# EasyEDA Pro project ProPrj_Бабай (ByByte) Nano.epro

# Schematic main
Board Name: Board1; Create Date: 2025-09-03; Page Name: P1; Project Name: Бабай (ByByte) Lite; Schematic Name: main; Update Date: 2025-09-25; Company: EasyEDA.com; Page Size: A4; Version: V1.0
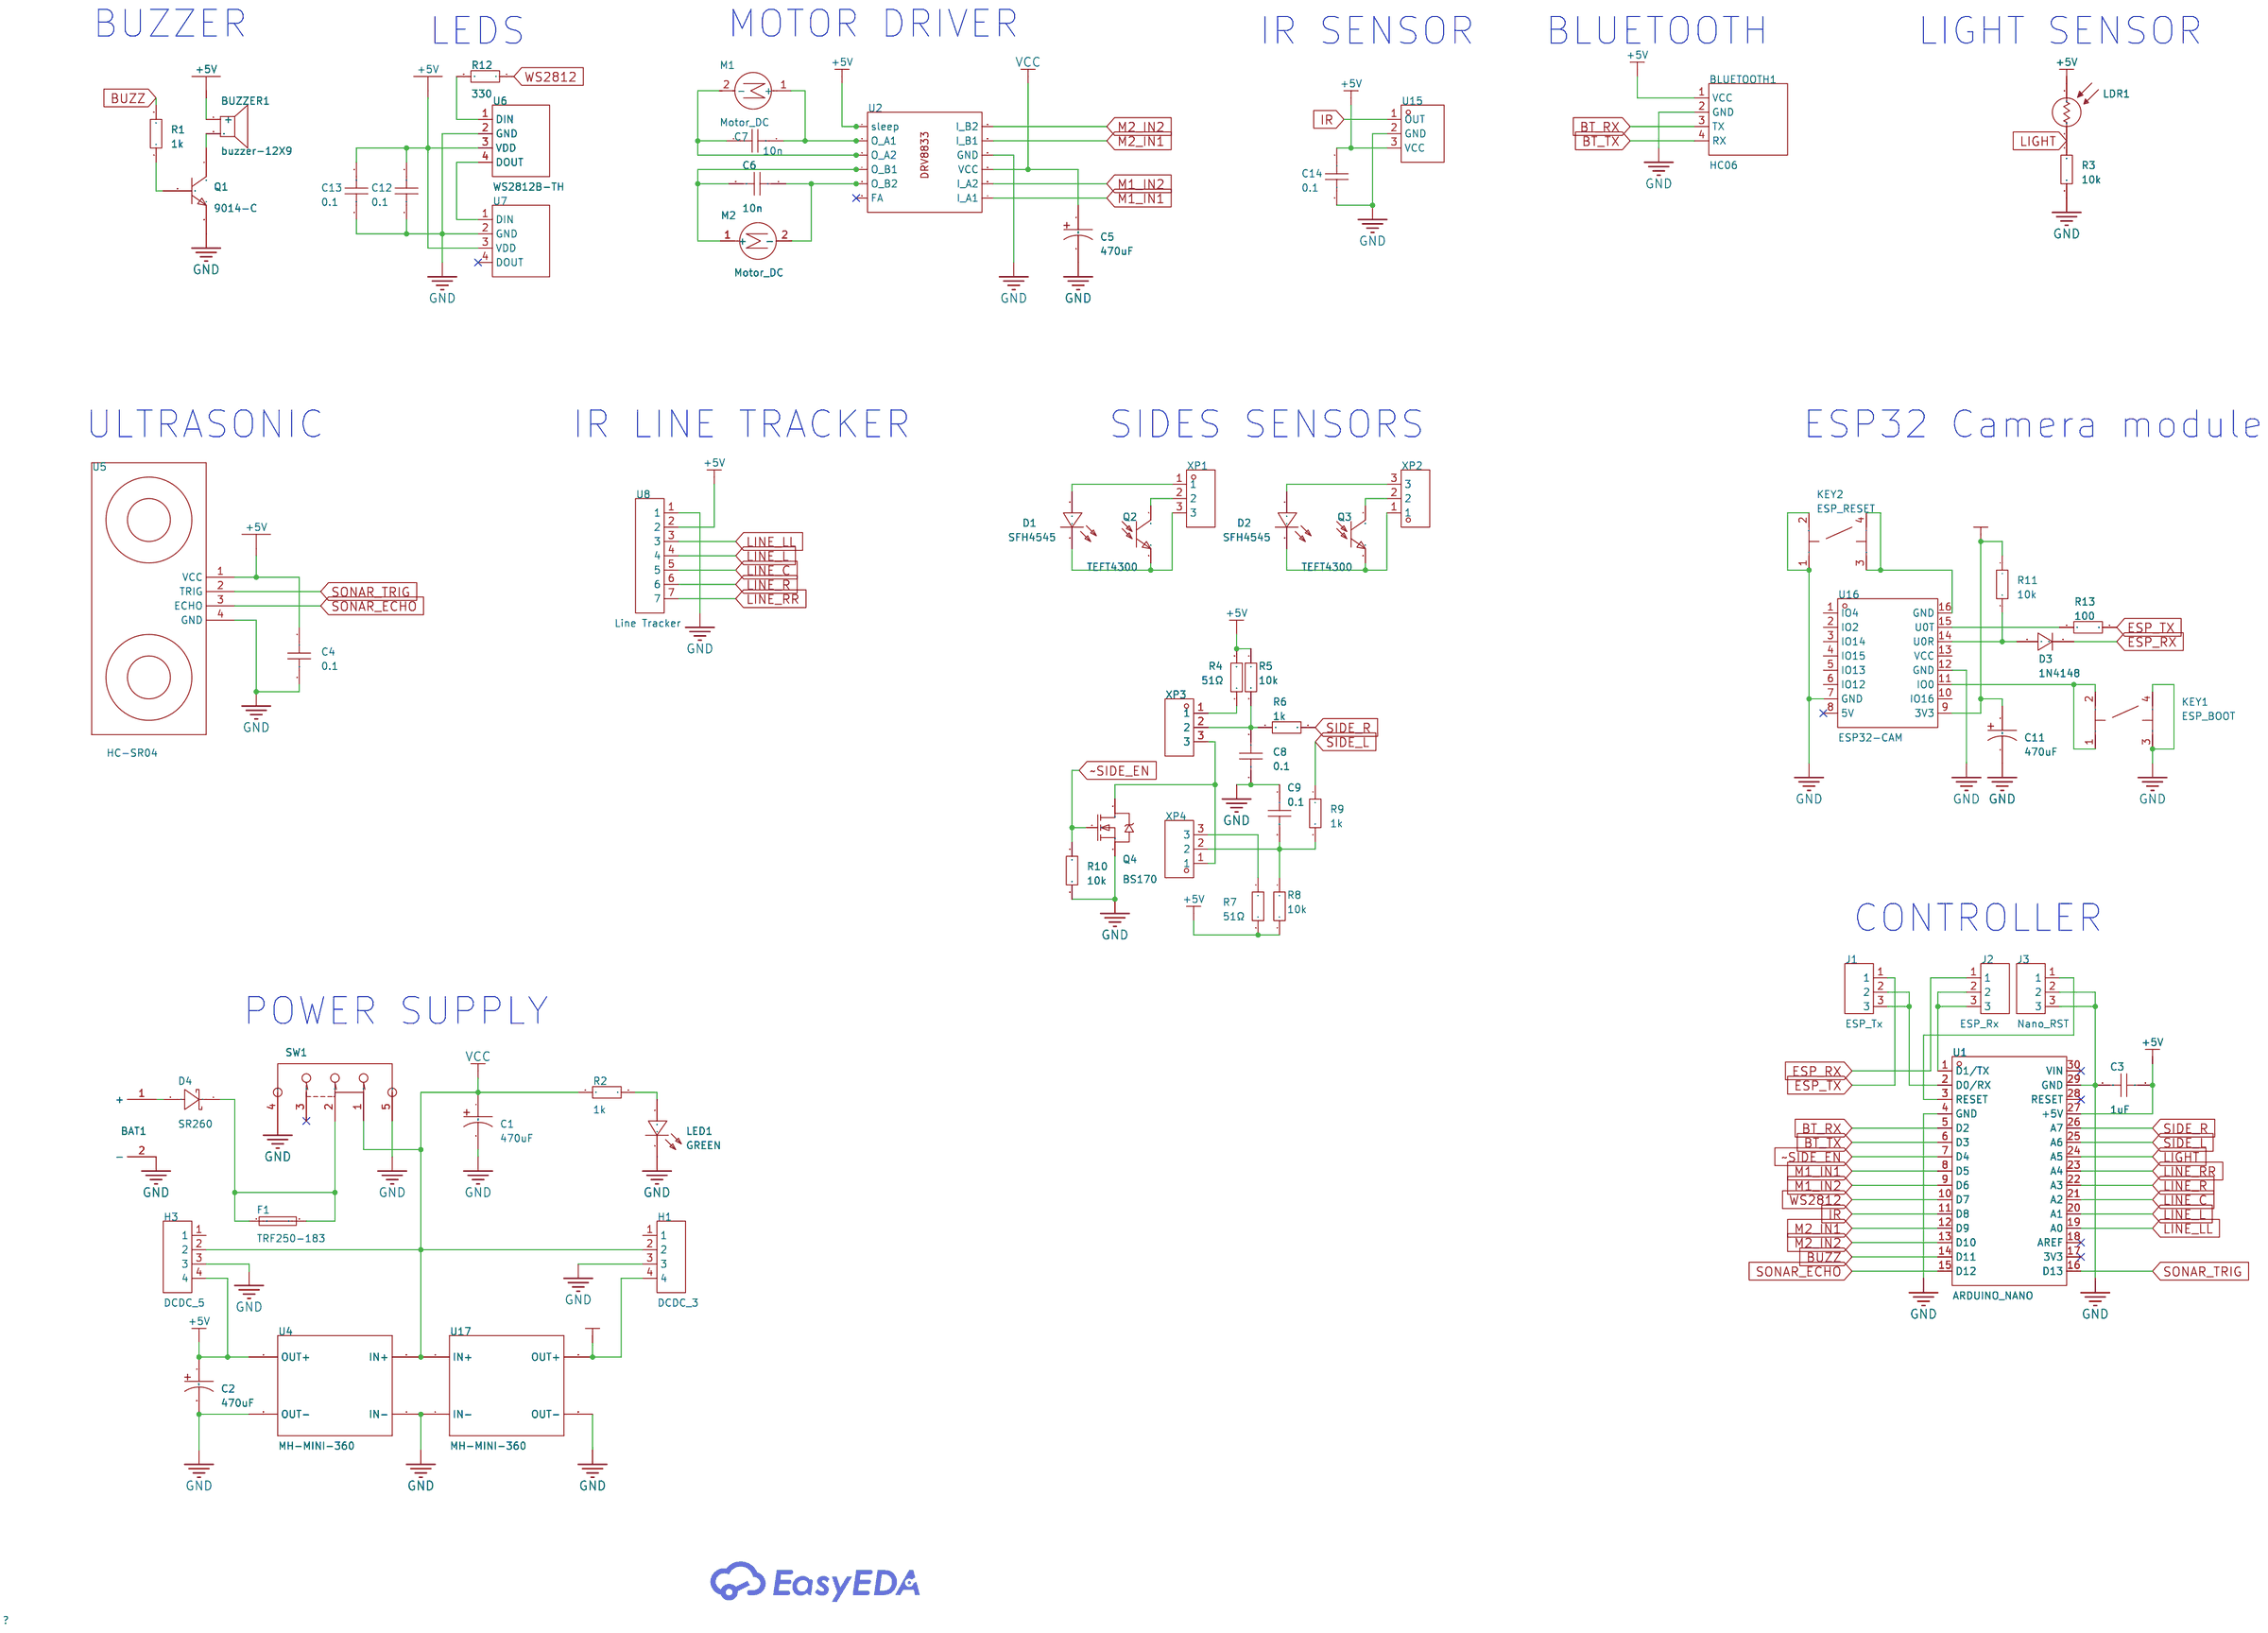
[diagram p0: schematic sheet]

## Parts
BAT1  -  [9V BATTERY]
BLUETOOTH1  HC06  [HC06]
BUZZER1  buzzer-12X9  [BUZ-TH_BD12.0-P7.60-D0.6-FD]
C1  470uF  [CAP-TH_BD8.0-P3.50-D0.6-FD-2]
C2  470uF  [CAP-TH_BD8.0-P3.50-D0.6-FD-2]
C3  1uF  [CAP-TH_L4.0-W2.5-P2.50-D0.5]
C4  0.1  [CAP-TH_L4.0-W2.5-P2.50-D0.5]
C5  470uF  [CAP-TH_BD8.0-P3.50-D0.6-FD-2]
C6  10n  [CAP-TH_L4.0-W2.5-P2.50-D0.5]
C7  10n  [CAP-TH_L4.0-W2.5-P2.50-D0.5]
C8  0.1  [CAP-TH_L4.0-W2.5-P2.50-D0.5]
C9  0.1  [CAP-TH_L4.0-W2.5-P2.50-D0.5]
C11  470uF  [CAP-TH_BD8.0-P3.50-D0.6-FD-2]
C12  0.1  [CAP-TH_L4.0-W2.5-P2.50-D0.5]
C13  0.1  [CAP-TH_L4.0-W2.5-P2.50-D0.5]
C14  0.1  [CAP-TH_L4.0-W2.5-P2.50-D0.5]
D1  SFH4545  [LED-TH_BD5.0-P2.54-FD]
D2  SFH4545  [LED-TH_BD5.0-P2.54-FD]
D3  1N4148  [DO-35_BD2.0-L4.0-P8.0-D0.5-RD]
D4  SR260  [Diode_THT:D_DO-15_P5.08mm_Vertical_KathodeUp]
F1  TRF250-183  [FUSE-TH_L7.5-W3.8-P5.00-D0.8]
H1  DCDC_3  [HDR-TH_4P-P2.54-V-F]
H3  DCDC_5  [HDR-TH_4P-P2.54-V-F]
J1  ESP_Tx  [HDR-TH_3P-P2.54-V-M-A]
J2  ESP_Rx  [HDR-TH_3P-P2.54-V-M-A]
J3  Nano_RST  [HDR-TH_3P-P2.54-V-M-A]
KEY1  ESP_BOOT  [KEY-TH_4P-L6.0-W6.0-P6.50-LS4.5]
KEY2  ESP_RESET  [KEY-TH_4P-L6.0-W6.0-P6.50-LS4.5]
LDR1  -  [PHOTO_RESISTOR]
LED1  PWR  [LED-TH_BD3.0-P2.54-FD-GREEN]
M1  Motor_DC  [N20_DC_MOTOR 3D]
M2  Motor_DC  [N20_DC_MOTOR 3D]
Q1  9014-C  [TO-92-3_L4.8-W3.7-P2.54-R]
Q2  TEFT4300  [SENSOR-TH_TEFT4300]
Q3  TEFT4300  [SENSOR-TH_TEFT4300]
Q4  BS170  [TO-92-3_L4.8-W3.7-P2.54-L]
R1  1k  [RES-TH_BD1.8-L3.2-P7.20-D0.4]
R2  1k  [RES-TH_BD1.8-L3.2-P7.20-D0.4]
R3  10k  [RES-TH_BD1.8-L3.2-P7.20-D0.4]
R4  51Ω  [R_AXIAL-0.4]
R5  10k  [RES-TH_BD1.8-L3.2-P7.20-D0.4]
R6  1k  [RES-TH_BD1.8-L3.2-P7.20-D0.4]
R7  51Ω  [R_AXIAL-0.4]
R8  10k  [RES-TH_BD1.8-L3.2-P7.20-D0.4]
R9  1k  [RES-TH_BD1.8-L3.2-P7.20-D0.4]
R10  10k  [RES-TH_BD1.8-L3.2-P7.20-D0.4]
R11  10k  [RES-TH_BD1.8-L3.2-P7.20-D0.4]
R12  330  [RES-TH_BD1.8-L3.2-P7.20-D0.4]
R13  100  [RES-TH_BD1.8-L3.2-P7.20-D0.4]
SW1  SW-TH_HOOYA_SS-12D11G4  [SW-TH_HOOYA_SS-12D11G4]
U1  ARDUINO_NANO  [COMM-TH_ARDUINO_NANO]
U2  -  [DRV8833]
U4  MH-MINI-360  [DC-DC-STEP-DOWN-MP2307]
U5  HC-SR04  [ULTRASONIC-HC-SR04#V]
U6  WS2812B-TH  [LED-TH_4P-BD5.8_WS2812B-TH]
U7  WS2812B-TH  [LED-TH_4P-BD5.8_WS2812B-TH]
U8  Line Tracker  [HDR-TH_7P-P2.54-V-F]
U15  D38  [OPTO-TH_VS1838B]
U16  ESP32-CAM  [COMM-TH_16P-L40.0-W27.0-P2.54_ESP32-CAM]
U17  MH-MINI-360  [DC-DC-STEP-DOWN-MP2307]
XP1  D32  [HDR-TH_3P-P2.54-V-M]
XP2  D32  [HDR-TH_3P-P2.54-V-M]
XP3  D32  [HDR-TH_3P-P2.54-V-M]
XP4  D32  [HDR-TH_3P-P2.54-V-M]

## Library data of the parts
BAT1 = BH9VPC: https://www.digikey.com/en/products/detail/mpd-memory-protection-devices/BH9VPC/31510
BLUETOOTH1 = HC06: Supplier: LCSC; _: 3
BUZZER1 = BUZZER-12X9: Supplier Part: C9900016920; Supplier Footprint: BUZZER_SMT_9650B; Datasheet: https://atta.szlcsc.comnull; Supplier: LCSC
C1 C2 C5 C11 = RXW471M1CBK-0811: Capacitance:470uF Tolerance:±20% Tolerance:±20% Voltage Rating:16V Ripple Current:- Equivalent Series Resistance(ESR):- Pin Spacing:3.5mm Diameter:8mm Height - Seated (Max):11.5mm Lifetime:5000hrs@105℃; LCSC Part Name: 470uF ±20% 16V; Supplier Part: C134658; Manufacturer: Lelon(立隆); Supplier Footprint: 插件,D8xL11.5mm; JLCPCB Part Class: Extended Part; Datasheet: https://atta.szlcsc.com/upload/public/pdf/source/20190613/C384650_EFEC9297B5607DDE202AAAD5E3F76F5E.pdf; Supplier: LCSC; Tolerance: ±20%; Voltage Rating: 16V; Pin Spacing: 3.5mm; Diameter: 8mm; Height - Seated (Max): 11.5mm; Lifetime: 5000hrs@105℃
C3 C4 C6-C9 C12-C14 = FK18X5R1C105K: Capacitance: Tolerance:±10% Tolerance:±10% Voltage Rated: Temperature Coefficient:; LCSC Part Name: 1uF ±10% 16V; Supplier Part: C3693472; Manufacturer: TDK; JLCPCB Part Class: Extended Part; Datasheet: https://atta.szlcsc.com/upload/public/pdf/source/20171113/C140866_15105613015131115783.pdf; Supplier: LCSC; Tolerance: ±10%
D1 D2 = SFH4550: Supplier Part: C706747; Supplier: LCSC
D3 = 1N4148: Diode Configuration: Forward Voltage (Vf@If):- Reverse Voltage (Vr):- Average Rectified Current (Io):- Reverse Leakage Current:-; Supplier Part: C13769; Supplier Footprint: DO-35; JLCPCB Part Class: Extended Part; Supplier: LCSC
D4 = SR260: Diode Configuration:- Forward Voltage (Vf@If):700mV@2A Reverse Voltage (Vr):60V Rectified Current:2A Reverse Leakage Current (Ir):500uA@60V; LCSC Part Name: 电压:60V 电流:2A 停产; Supplier Part: C845406; Manufacturer: TF(拓锋); Supplier Footprint: DO-15; JLCPCB Part Class: Extended Part; Datasheet: https://atta.szlcsc.com/upload/public/pdf/source/20201103/C845406_FC0B483EC48C96AC55EDB1AB9BB06A33.pdf; Supplier: LCSC; Forward Voltage (Vf@If): 700mV@2A; Reverse Voltage (Vr): 60V; Rectified Current: 2A; Reverse Leakage Current (Ir): 500uA@60V
F1 = TRF250-183: Voltage - Max:100V Current - Max:10A Hold Current:183mA Trip Current:685mA Power Dissipation:900mW Resistance - Initial (Ri) (Min):600mΩ Resistance - Post Trip (R1) (Max):3.4Ω Time to Trip(Max):600ms Operating Temperature:-40℃~+85℃ Operating Temperature:-; LCSC Part Name: 250V 0.183A; Supplier Part: C413573; Manufacturer: Littelfuse(美国力特); Supplier Footprint: 插件; JLCPCB Part Class: Extended Part; Datasheet: https://item.szlcsc.com/datasheet/TRF250-183/405574.html; Supplier: LCSC; Voltage - Max: 100V; Current - Max: 10A; Hold Current: 183mA; Trip Current: 685mA; Power Dissipation: 900mW; Resistance - Initial (Ri) (Min): 600mΩ; Resistance - Post Trip (R1) (Max): 3.4Ω; Time to Trip(Max): 600ms; Operating Temperature: -40℃~+85℃
H1 H3 = HC-08蓝牙: Supplier Part: C9900016778; Supplier Footprint: HDR-TH_4P; JLCPCB Part Class: Extended Part; Supplier: LCSC
J1-J3 = Jumper3: Supplier Part: C2940050; Supplier Footprint: HDR-TH-3P-2.54mm; JLCPCB Part Class: Extended Part; Supplier: LCSC
KEY1 KEY2 = AN6*6: Supplier Part: C9900018275; Supplier Footprint: KEY-TH_4P-L6.0-W6.0-P4.50-LS6.50; JLCPCB Part Class: Extended Part; Supplier: LCSC
LDR1 = Photo-Resistor
LED1 = 插针式LEDF3: Supplier Part: C9900017231; Manufacturer Part: GREEN; Supplier Footprint: LED-TH_BD3.0; JLCPCB Part Class: Extended Part; Supplier: LCSC
M1 M2 = Motor_DC: license: https://www.gnu.org/licenses/lgpl-2.1.html
Q1 = 9014-C: type:NPN Current - Collector(Ic): Collector - Emitter Voltage VCEO: Pd - Power Dissipation: DC Current Gain:200@1mA,5V DC Current Gain:200@1mA,5V Transition frequency(fT):270MHz Current - Collector Cutoff:50nA Vce Saturation(VCE(sat)):140mV Operating Temp; Supplier Part: C305409; Manufacturer: BLUE ROCKET(蓝箭); Supplier Footprint: TO-92-3; Datasheet: https://atta.szlcsc.com/upload/public/pdf/source/20181016/C305409_957E989EA97400765401B68B49A4FDD8.pdf; Supplier: LCSC; type: NPN; DC Current Gain: 200@1mA,5V; Transition frequency(fT): 270MHz; Current - Collector Cutoff: 50nA; Vce Saturation(VCE(sat)): 140mV
Q2 Q3 = TEFT4300: Transistor Type:NPN Collector Emitter Voltage:70V Collector Emitter Voltage:70V Collector Current (Ic):50mA Dissipation Power(Max):100mW Collector Dark Current:1nA Peak Wavelength:925nm Viewing Angle:±30° Operating Temperature:-40℃~+100℃ Operating Tempera; LCSC Part Name: 925nm的NPN光电三极管; Supplier Part: C118301; Manufacturer: VISHAY(威世); Supplier Footprint: 插件,D=3mm; JLCPCB Part Class: Extended Part; Datasheet: https://atta.szlcsc.com/upload/public/pdf/source/20170713/C118301_1499918878961816729.pdf; Supplier: LCSC; Transistor Type: NPN; Collector Emitter Voltage: 70V; Collector Current (Ic): 50mA; Dissipation Power(Max): 100mW; Collector Dark Current: 1nA; Peak Wavelength: 925nm; Viewing Angle: ±30°; Operating Temperature: -40℃~+100℃
Q4 = BS170-D26Z: Type:1 N-Channel Drain Source Voltage (Vdss): Continuous Drain Current (Id): Drain Source On Resistance (RDS(on)@Vgs,Id):5Ω@10V,200mA Power Dissipation (Pd): Gate Threshold Voltage (Vgs(th)@Id):3V@1mA Input Capacitance (Ciss@Vds):40pF@10V Operating Temper; LCSC Part Name: 1个N沟道 耐压:60V 电流:500mA; Supplier Part: C258163; Manufacturer: onsemi(安森美); Supplier Footprint: TO-92-3; JLCPCB Part Class: Extended Part; Datasheet: https://atta.szlcsc.com/upload/public/pdf/source/20180829/C258163_1806696338258A85C7E3E0B8B7F025DB.pdf; Supplier: LCSC; Type: 1 N-Channel; Drain Source On Resistance (RDS(on)@Vgs,Id): 5Ω@10V,200mA; Gate Threshold Voltage (Vgs(th)@Id): 3V@1mA; Input Capacitance (Ciss@Vds): 40pF@10V; Operating Temperature: -55℃~+150℃@(Tj)
R1-R3 R5 R6 R8-R13 = Res_AXIAL-1/8W: Supplier Footprint: Through
R4 R7 = Res_AXIAL-1/4W: Supplier Footprint: Through
SW1 = SW-TH_HOOYA_SS-12D11G4: link: https://atta.szlcsc.com/upload/public/pdf/source/20220518/EE8C01AB75DB93BD50D8A6D13330ACA3.pdf
U1 = ARDUINO_NANO: Supplier Part: C9900017879; Supplier Footprint: 插件; JLCPCB Part Class: Extended Part; Supplier: LCSC
U2 = DRV8833
U4 U17 = #promini_DC-DC-STEP-DOWN-MP2307_
U5 = ULTRASONIC-HC-SR04_#V
U6 U7 = WS2812B-TH: Supplier Part: C9900193997; Supplier Footprint: 插件; Supplier: LCSC
U8 = 7位插座: Supplier Part: C9900023763; Supplier Footprint: HDR-TH-7P; JLCPCB Part Class: Extended Part; Supplier: LCSC
U15 = VS1838B: Supplier Part: C9900002107; Supplier Footprint: TH-3_4.8X6.7X2.54P; Supplier: LCSC
U16 = ESP32-CAM: ESP32-CAM_AI-THINKER; Supplier Part: C277946; Manufacturer: Ai-Thinker(安信可); Supplier Footprint: 插件; JLCPCB Part Class: Extended Part; Datasheet: https://atta.szlcsc.com/upload/public/pdf/source/20180906/C277946_000C39242C68478A3C556AF60BF76A1F.pdf; Supplier: LCSC
XP1-XP4 = 5-146277-3: Pitch:2.54mm Circluar Pins/Square Pins:Square Pins Mounting Type:Straight Number of Rows:Plugin Number of Pins:3P Current Rating (Max):3A Voltage Rating (Max):- Length of Mating Pin:8.08mm Insulation Height:2.29mm Length of End Connection Pin:3.18mm Conta; LCSC Part Name: 间距:2.54mm 直插 方针; Supplier Part: C3327863; Manufacturer: TE Connectivity(泰科电子); Supplier Footprint: 插件,P=2.54mm; JLCPCB Part Class: Extended Part; Datasheet: https://atta.szlcsc.com/upload/public/pdf/source/20240320/B5A87472A4F0F2898233D24AD0789840.pdf; Supplier: LCSC; Pitch: 2.54mm; Circluar Pins/Square Pins: Square Pins; Mounting Type: Straight; Number of Rows: Plugin; Number of Pins: 3P; Current Rating (Max): 3A; Length of Mating Pin: 8.08mm; Insulation Height: 2.29mm; Length of End Connection Pin: 3.18mm; Contact Plating: Tin; Operating Temperature Range: -65℃~+105℃; Color: Black

## Nets
+3.3V: C11.1 H1.4 R11.1 U16.9(3V3) U17.OUT+
+5V: BLUETOOTH1.1(VCC) BUZZER1.1(+) C2.1 C3.2 C4.1 C12.1 C13.1 C14.1 H3.4 LDR1.1 R4.2 R5.1 R7.2 R8.2 U1.27(+5V) U2.1(sleep) U4.OUT+ U5.1(VCC) U6.3(VDD) U7.3(VDD) U8.2 U15.3(VCC)
GND: BAT1.2(-) BLUETOOTH1.2(GND) C1.2 C2.2 C3.1 C4.2 C5.2 C8.1 C9.1 C11.2 C12.2 C13.2 C14.2 H1.3 H3.3 J3.2 J3.3 KEY1.3 KEY1.4 KEY2.1 KEY2.2 LED1.2(K) Q1.3(E) Q4.3(S) R3.1 R10.2 SW1.4 SW1.5 U1.4(GND) U1.29(GND) U2.10(GND) U4.IN- U4.OUT- U5.4(GND) U6.2(GND) U7.2(GND) U8.1 U15.2(GND) U16.7(GND) U16.12(GND) U17.IN- U17.OUT-
VCC: C1.1 C5.1 H1.2 H3.2 R2.2 SW1.1 U2.9(VCC) U4.IN+ U17.IN+
BT_RX: BLUETOOTH1.3(TX) U1.5(D2)
BT_TX: BLUETOOTH1.4(RX) U1.6(D3)
BUZZ: R1.2 U1.14(D11)
ESP_RX: D3.1 J2.1
ESP_TX: J1.1 R13.2
IR: U1.11(D8) U15.1(OUT)
LIGHT: LDR1.2 R3.2 U1.24(A5)
LINE_C: U1.21(A2) U8.5
LINE_L: U1.20(A1) U8.4
LINE_LL: U1.19(A0) U8.3
LINE_R: U1.22(A3) U8.6
LINE_RR: U1.23(A4) U8.7
M1_IN1: U1.8(D5) U2.7(I_A1)
M1_IN2: U1.9(D6) U2.8(I_A2)
M2_IN1: U1.12(D9) U2.11(I_B1)
M2_IN2: U1.13(D10) U2.12(I_B2)
SIDE_L: R9.1 U1.25(A6)
SIDE_R: R6.1 U1.26(A7)
SONAR_ECHO: U1.15(D12) U5.3(ECHO)
SONAR_TRIG: U1.16(D13) U5.2(TRIG)
WS2812: R12.1 U1.10(D7)
~SIDE_EN: Q4.2(G) R10.1 U1.7(D4)
$1N1464: Q1.2(B) R1.1
$1N1467: BUZZER1.2 Q1.1(C)
$1N1626: R12.2 U6.1(DIN)
$1N1633: U6.4(DOUT) U7.1(DIN)
$1N4176: LED1.1(A) R2.1
$1N4272: C7.2 M1.1(+) U2.2(O_A1)
$1N4279: C7.1 M1.2(-) U2.3(O_A2)
$1N5250: Q2.1(C) XP1.2
$1N5251: D1.2(K) Q2.2(E) XP1.3
$1N5405: D1.1(A) XP1.1
$1N5525: D2.2(K) Q3.2(E) XP2.1
$1N5528: Q3.1(C) XP2.2
$1N5529: D2.1(A) XP2.3
$1N5700: R4.1 XP3.1
$1N5728: C8.2 R5.2 R6.2 XP3.2
$1N5983: R7.1 XP4.3
$1N6012: C9.2 R8.1 R9.2 XP4.2
$1N6146: Q4.1(D) XP3.3 XP4.1
$1N7817: J3.1 U1.3(RESET)
$1N7877: J2.2 J2.3 U1.1(D1/TX)
$1N8038: D3.2 R11.2 U16.14(U0R)
$1N8431: KEY1.1 KEY1.2 U16.11(IO0)
$1N8535: KEY2.3 KEY2.4 U16.16(GND)
$1N9044: C6.2 M2.1(+) U2.4(O_B1)
$1N9105: C6.1 M2.2(-) U2.5(O_B2)
$1N12441: R13.1 U16.15(U0T)
$1N12605: J1.2 J1.3 U1.2(D0/RX)
$1N12810: D4.1(K) F1.1 F1.2 SW1.2
$1N12946: BAT1.1(+) D4.2(A)

Not connected (* = marked no-connect by the designer): H1 1; H3 1; SW1 3*; U1 17(3V3)* 18(AREF)* 28(RESET)* 30(VIN)*; U2 6(FA)*; U7 4(DOUT)*; U16 1(IO4) 2(IO2) 3(IO14) 4(IO15) 5(IO13) 6(IO12) 8(5V)* 10(IO16) 13(VCC)

## Notes on the sheet
- BUZZER
- MOTOR DRIVER
- LEDS
- IR SENSOR
- BLUETOOTH
- LIGHT SENSOR
- ULTRASONIC
- IR LINE TRACKER
- SIDES SENSORS
- ESP32 Camera module
- CONTROLLER
- POWER SUPPLY

# Board PCB1
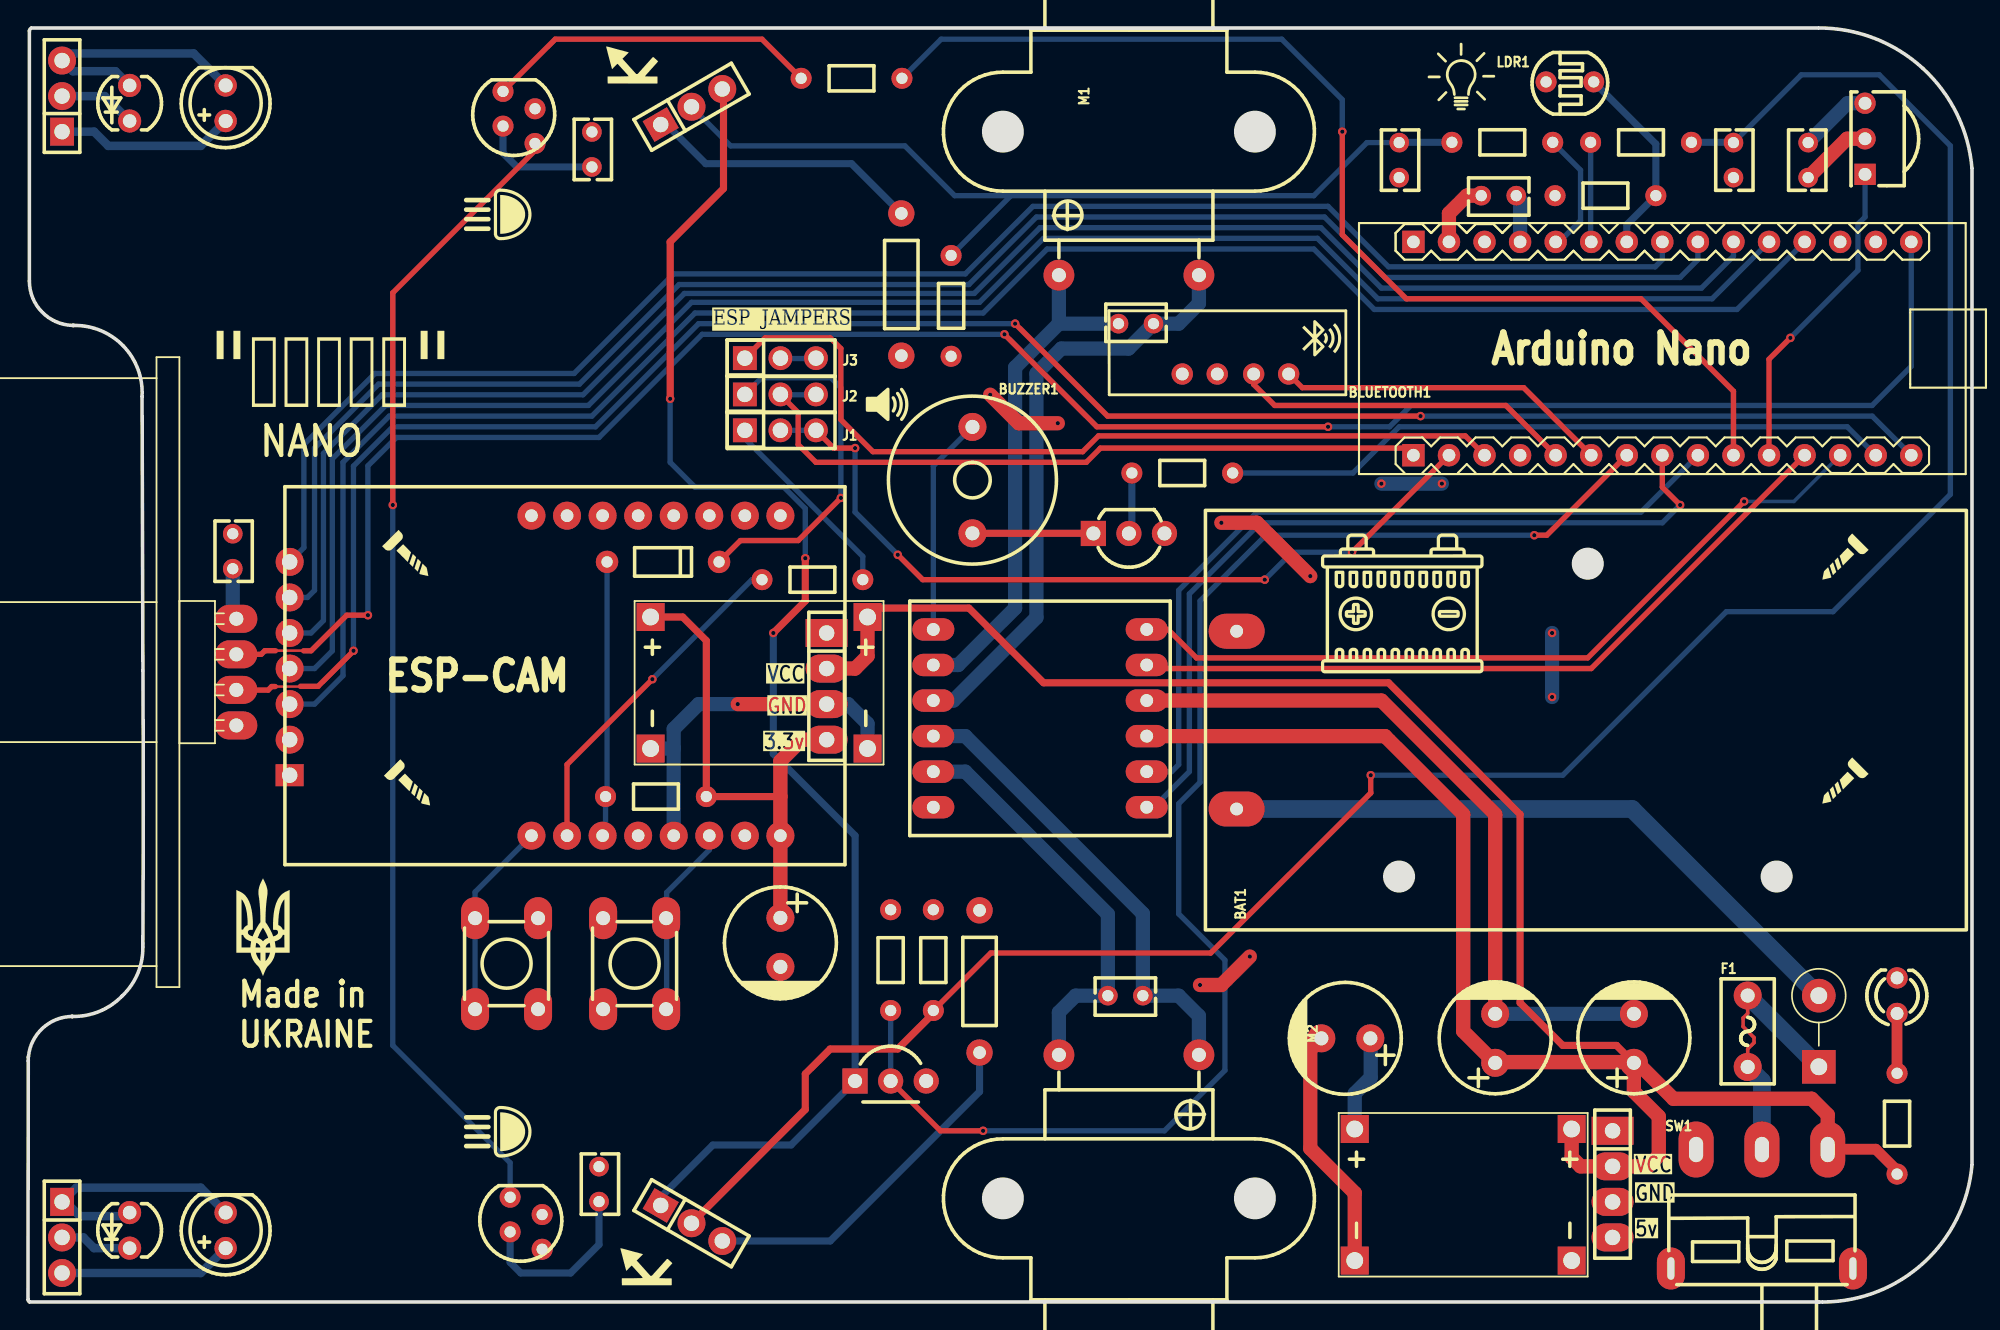
[diagram p1: board, top side]
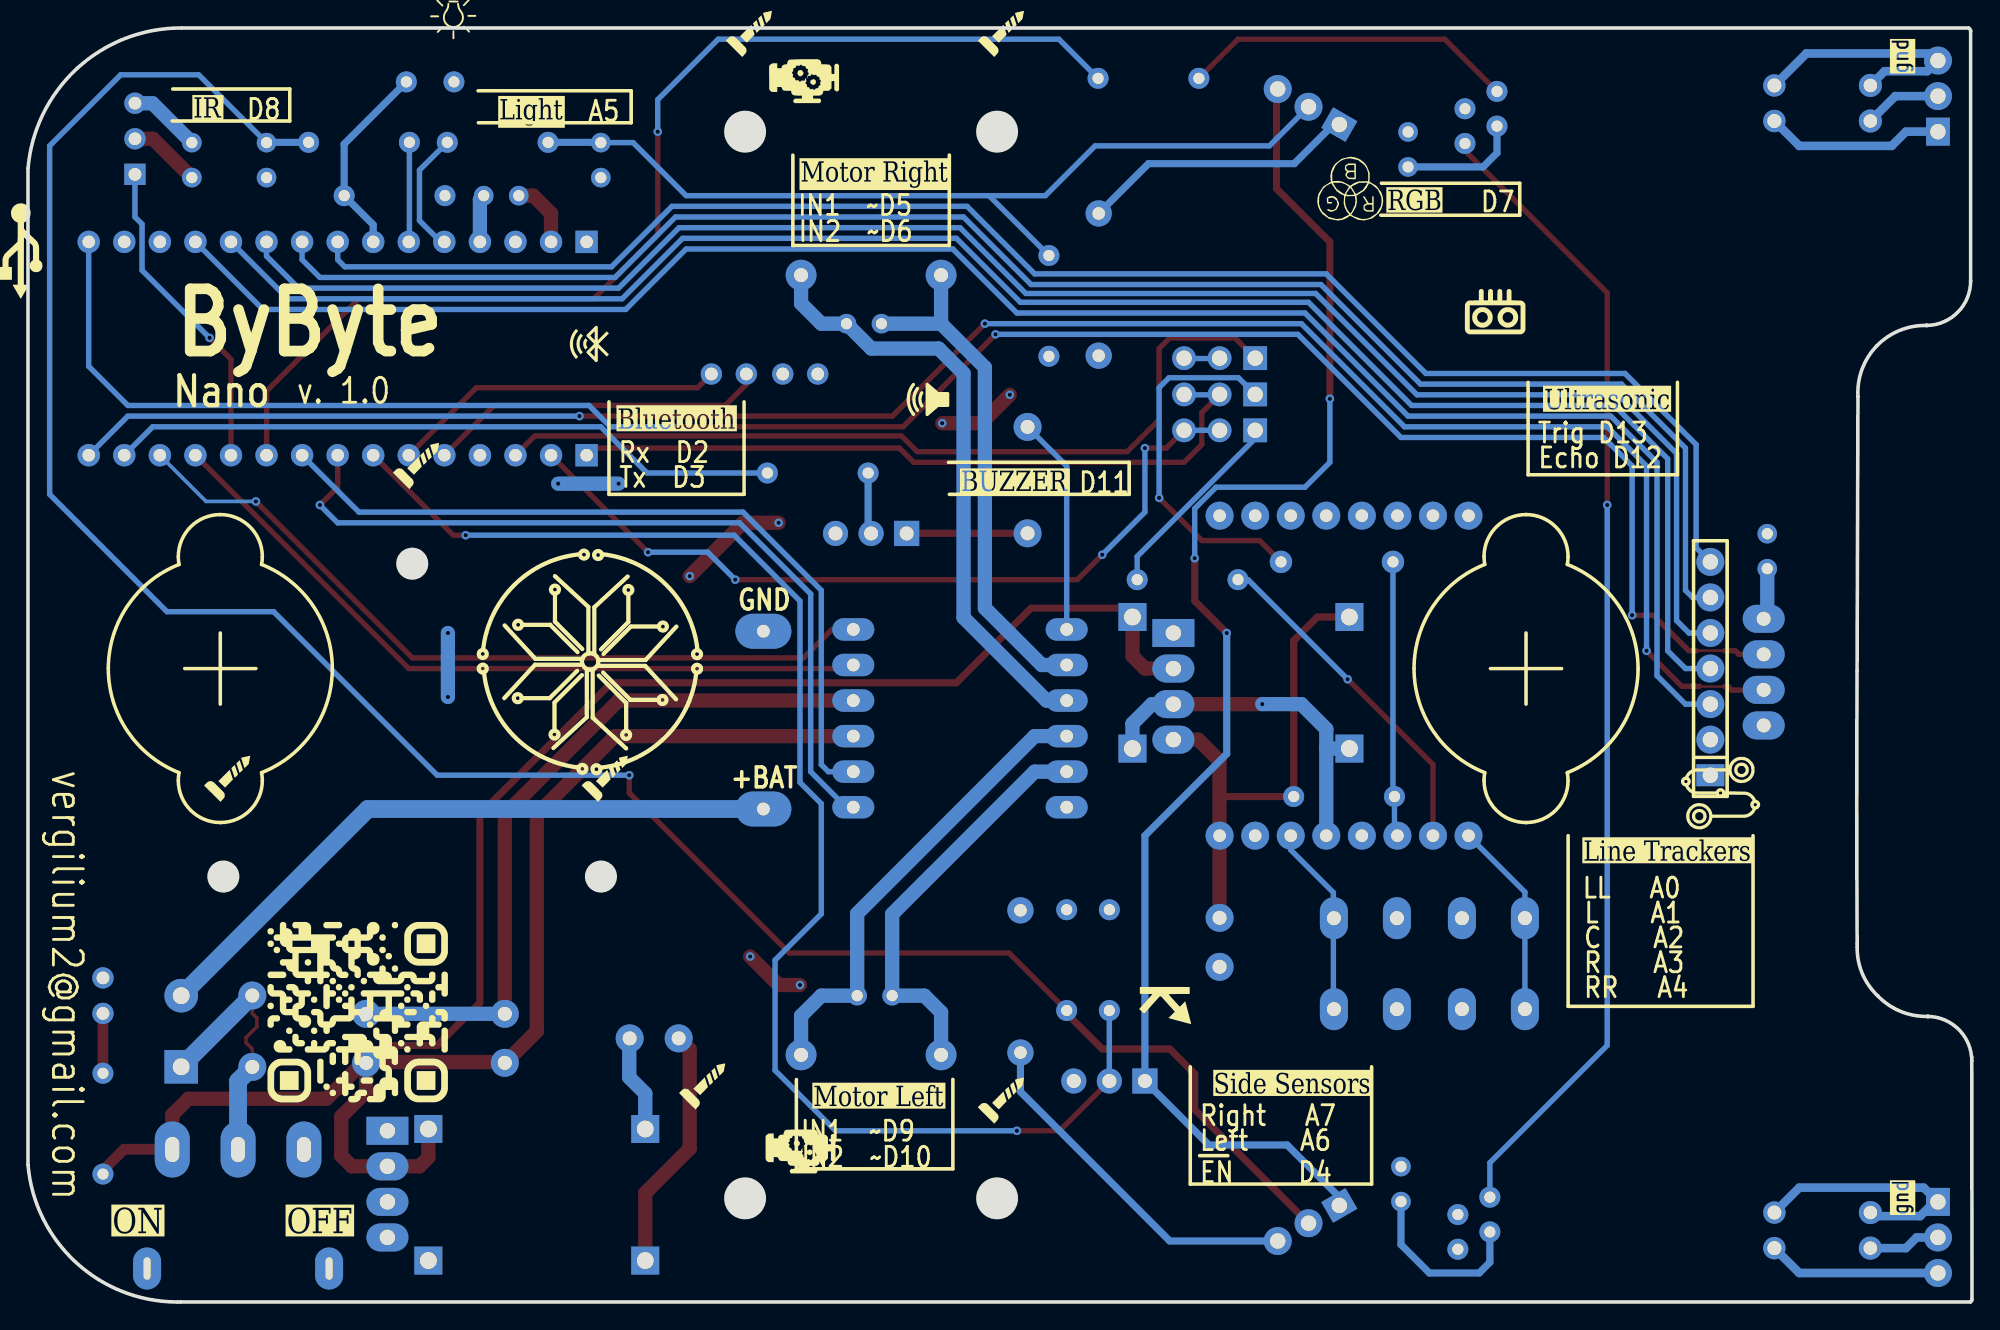
[diagram p2: board, bottom side, seen from below]

Outline 138.85 x 91.01 mm; copper layers: Top Layer, Bottom Layer. Coordinates in mm from the lower left corner of the outline.
Outline path: 0,0.19 0.02,17.22 arc(0.02,17.23) 0.02,17.23 0.02,17.48 arc(0.02,17.51) 0.03,17.54 arc(1.03,19.55) 3.12,20.4 arc(3.13,20.4) 3.14,20.4 arc(3.15,20.4) 3.16,20.39 arc(3.17,20.4) 3.18,20.4 arc(3.19,20.4) 3.2,20.4 arc(5.12,20.77) 6.74,21.88 arc(7.84,23.47) 8.2,25.37 8.2,25.61 arc(8.22,35.35) 8.21,45.09 8.15,64.69 arc(7.86,66.63) 6.82,68.29 arc(5.2,69.39) 3.28,69.76 arc(3.27,69.76) 3.25,69.76 arc(3.24,69.77) 3.24,69.77 arc(3.23,69.77) 3.22,69.76 arc(3.21,69.76) 3.2,69.76 arc(1,70.72) 0.1,72.94 0.1,90.8 arc(0.14,90.93) 0.25,91.01 127.89,91.01 arc(131.88,90.27) 135.33,88.13 arc(137.77,84.88) 138.85,80.97 138.85,9.8 arc(135.42,2.82) 128.17,0 arc(128.05,0) 127.93,0 0.12,0 arc(0.03,0.08) 0,0.19
Stack: Top Layer 0.035mm / Dielectric1 1.51mm FR4 er 4.5 / Bottom Layer 0.035mm

## Design rules (mm)
template: JLCPCB Capability(Two Layers Board)
spacing copperThickness1oz (default): track to track 0.102, other pairs 0.152 to 0.3
spacing copperThickness2oz: track to track 0.203, other pairs 0.152 to 0.3
track width copperThickness1oz (default): min 0.127, default 0.254, max 2.54
track width copperThickness2oz: min 0.203, default 0.254, max 2.54
differential pair differentialPair (default): width min 0.127, default 0.254, max 2.54; gap min 0.152, default 0.152
via viaSize (default): diameter min 0.5, default 0.61, max 10; hole min 0.3, default 0.305, max 6.3

## Placement (name value [footprint] x y rotation side)
BAT1  -  [9V BATTERY]  111.14 41.95 180 top
BLUETOOTH1  -  [HC06]  94.13 64.81 180 top
BUZZER1  buzzer-12X9  [BUZ-TH_BD12.0-P7.60-D0.6-FD]  67.46 58.71 270 top
C1  470uF  [CAP-TH_BD8.0-P3.50-D0.6-FD-2]  114.7 18.84 90 top
C2  470uF  [CAP-TH_BD8.0-P3.50-D0.6-FD-2]  94.13 18.84 180 top
C3  1uF  [CAP-TH_L4.0-W2.5-P2.50-D0.5]  105.05 79.03 0 top
C4  0.1  [CAP-TH_L4.0-W2.5-P2.50-D0.5]  14.62 53.63 90 top
C5  470uF  [CAP-TH_BD8.0-P3.50-D0.6-FD-2]  104.79 18.84 90 top
C6  10n  [CAP-TH_L4.0-W2.5-P2.50-D0.5]  78.38 21.88 0 top
C7  10n  [CAP-TH_L4.0-W2.5-P2.50-D0.5]  79.14 69.89 180 top
C8  0.1  [CAP-TH_L4.0-W2.5-P2.50-D0.5]  97.94 81.57 90 top
C9  0.1  [CAP-TH_L4.0-W2.5-P2.50-D0.5]  121.81 81.57 90 top
C11  470uF  [CAP-TH_BD8.0-P3.50-D0.6-FD-2]  53.74 25.69 270 top
C12  0.1  [CAP-TH_L4.0-W2.5-P2.50-D0.5]  40.28 82.34 90 top
C13  0.1  [CAP-TH_L4.0-W2.5-P2.50-D0.5]  40.79 8.42 90 top
C14  0.1  [CAP-TH_L4.0-W2.5-P2.50-D0.5]  127.15 81.57 270 top
D1  SFH4545  [LED-TH_BD5.0-P2.54-FD]  14.12 85.64 90 top
D2  SFH4545  [LED-TH_BD5.0-P2.54-FD]  14.12 5.12 90 top
D3  1N4148  [DO-35_BD2.0-L4.0-P8.0-D0.5-RD]  45.36 52.87 180 top
D4  SR260  [Diode_THT:D_DO-15_P5.08mm_Vertical_KathodeUp]  127.91 16.8 90 top
F1  TRF250-183  [FUSE-TH_L7.5-W3.8-P5.00-D0.8]  122.83 19.34 270 top
H1  DCDC_3  [HDR-TH_4P-P2.54-V-F]  57.04 43.98 270 top
H3  DCDC_5  [HDR-TH_4P-P2.54-V-F]  113.18 8.42 270 top
J1  ESP_Tx  [HDR-TH_3P-P2.54-V-M-A]  53.74 62.27 0 top
J2  ESP_Rx  [HDR-TH_3P-P2.54-V-M-A]  53.74 64.84 0 top
J3  Nano_RST  [HDR-TH_3P-P2.54-V-M-A]  53.74 67.43 0 top
KEY1  ESP_BOOT  [KEY-TH_4P-L6.0-W6.0-P6.50-LS4.5]  43.33 24.17 270 top
KEY2  ESP_RESET  [KEY-TH_4P-L6.0-W6.0-P6.50-LS4.5]  34.18 24.17 270 top
LDR1  -  [PHOTO_RESISTOR]  110.13 87.16 90 top
LED1  PWR  [LED-TH_BD3.0-P2.54-FD-GREEN]  133.5 21.88 90 top
M1  Motor_DC  [N20_DC_MOTOR 3D]  78.63 83.61 90 top
M2  Motor_DC  [N20_DC_MOTOR 3D]  78.63 7.41 270 top
Q1  9014-C  [TO-92-3_L4.8-W3.7-P2.54-R]  78.63 54.9 180 top
Q2  TEFT4300  [SENSOR-TH_TEFT4300]  7.26 85.64 180 top
Q3  TEFT4300  [SENSOR-TH_TEFT4300]  7.26 5.12 180 top
Q4  BS170  [TO-92-3_L4.8-W3.7-P2.54-L]  61.61 15.79 0 top
R1  1k  [RES-TH_BD1.8-L3.2-P7.20-D0.4]  82.44 59.22 0 top
R2  1k  [RES-TH_BD1.8-L3.2-P7.20-D0.4]  133.5 12.74 270 top
R3  10k  [RES-TH_BD1.8-L3.2-P7.20-D0.4]  112.67 79.03 0 top
R4  51Ω  [R_AXIAL-0.4]  62.38 72.68 270 top
R5  10k  [RES-TH_BD1.8-L3.2-P7.20-D0.4]  65.93 71.16 90 top
R6  1k  [RES-TH_BD1.8-L3.2-P7.20-D0.4]  105.3 82.84 180 top
R7  51Ω  [R_AXIAL-0.4]  67.96 22.9 90 top
R8  10k  [RES-TH_BD1.8-L3.2-P7.20-D0.4]  64.66 24.42 90 top
R9  1k  [RES-TH_BD1.8-L3.2-P7.20-D0.4]  115.21 82.84 0 top
R10  10k  [RES-TH_BD1.8-L3.2-P7.20-D0.4]  61.61 24.42 90 top
R11  10k  [RES-TH_BD1.8-L3.2-P7.20-D0.4]  44.85 36.11 180 top
R12  330  [RES-TH_BD1.8-L3.2-P7.20-D0.4]  58.82 87.42 180 top
R13  100  [RES-TH_BD1.8-L3.2-P7.20-D0.4]  56.03 51.6 0 top
SW1  -  [SW-TH_HOOYA_SS-12D11G4]  123.84 6.64 0 top
U1  ARDUINO_NANO  [COMM-TH_ARDUINO_NANO]  116.73 68.11 180 top
U2  -  [DRV8833]  72.28 41.7 0 top
U4  MH-MINI-360  [DC-DC-STEP-DOWN-MP2307]  102.51 7.66 180 top
U5  HC-SR04  [ULTRASONIC-HC-SR04#V]  14.88 45 270 top
U6  WS2812B-TH  [LED-TH_4P-BD5.8_WS2812B-TH]  34.69 84.62 90 top
U7  WS2812B-TH  [LED-TH_4P-BD5.8_WS2812B-TH]  35.2 5.63 90 top
U8  Line Tracker  [HDR-TH_7P-P2.54-V-F]  18.69 45.25 90 bottom
U15  D38  [OPTO-TH_VS1838B]  131.21 83.1 90 top
U16  ESP32-CAM  [COMM-TH_16P-L40.0-W27.0-P2.54_ESP32-CAM]  44.85 44.74 90 top
U17  MH-MINI-360  [DC-DC-STEP-DOWN-MP2307]  52.22 44.24 180 top
XP1  D32  [HDR-TH_3P-P2.54-V-M]  2.43 86.15 90 top
XP2  D32  [HDR-TH_3P-P2.54-V-M]  2.43 4.61 270 top
XP3  D32  [HDR-TH_3P-P2.54-V-M]  47.39 85.38 30 top
XP4  D32  [HDR-TH_3P-P2.54-V-M]  47.39 5.63 330 top

## Footprints (pads in the part's own frame, mm; a bottom-side part is the same pattern mirrored in y, then rotated)
9V BATTERY
  oval 4x2.5 hole 0.914: 1(24.818,6.731) 2(24.818,-5.969)
BUZ-TH_BD12.0-P7.60-D0.6-FD
  round 2 hole 1: 1(-3.8,0) 2(3.8,0)
CAP-TH_BD8.0-P3.50-D0.6-FD-2
  round 2 hole 1: 1(-1.75,0) 2(1.75,0)
CAP-TH_L4.0-W2.5-P2.50-D0.5
  round 1.4 hole 0.8: 1(-1.25,0) 2(1.25,0)
COMM-TH_16P-L40.0-W27.0-P2.54_ESP32-CAM
  round 2 hole 0.9: 1(11.43,8.89) 2(11.43,6.35) 3(11.43,3.81) 4(11.43,1.27) 5(11.43,-1.27) 6(11.43,-3.81) 7(11.43,-6.35) 8(11.43,-8.89) 9(-11.43,-8.89) 10(-11.43,-6.35) 11(-11.43,-3.81) 12(-11.43,-1.27) 13(-11.43,1.27) 14(-11.43,3.81) 15(-11.43,6.35) 16(-11.43,8.89)
COMM-TH_ARDUINO_NANO
  rect 1.6x1.6 hole 0.9: 1(17.78,7.62) 30(17.78,-7.62)
  round 1.6 hole 0.9: 2(15.24,7.62) 3(12.7,7.62) 4(10.16,7.62) 5(7.62,7.62) 6(5.08,7.62) 7(2.54,7.62) 8(0,7.62) 9(-2.54,7.62) 10(-5.08,7.62) 11(-7.62,7.62) 12(-10.16,7.62) 13(-12.7,7.62) 14(-15.24,7.62) 15(-17.78,7.62) 16(-17.78,-7.62) 17(-15.24,-7.62) 18(-12.7,-7.62) 19(-10.16,-7.62) 20(-7.62,-7.62) 21(-5.08,-7.62) 22(-2.54,-7.62) 23(0,-7.62) 24(2.54,-7.62) 25(5.08,-7.62) 26(7.62,-7.62) 27(10.16,-7.62) 28(12.7,-7.62) 29(15.24,-7.62)
DC-DC-STEP-DOWN-MP2307
  rect 2x2 hole 1.2: IN+(-7.747,-4.699) IN-(-7.747,4.699) OUT+(7.747,-4.699) OUT-(7.747,4.699)
Diode_THT:D_DO-15_P5.08mm_Vertical_KathodeUp
  rect 2.4x2.4 hole 1.2: 1(0,0)
  round 2.4 hole 1.2: 2(5.08,0)
DO-35_BD2.0-L4.0-P8.0-D0.5-RD
  round 1.6 hole 0.8: 1(-4,0) 2(4,0)
DRV8833
  oval 3x1.6 hole 0.914: 1(-7.62,6.35) 2(-7.62,3.81) 3(-7.62,1.27) 4(-7.62,-1.27) 5(-7.62,-3.81) 6(-7.62,-6.35) 7(7.62,-6.35) 8(7.62,-3.81) 9(7.62,-1.27) 10(7.62,1.27) 11(7.62,3.81) 12(7.62,6.35)
FUSE-TH_L7.5-W3.8-P5.00-D0.8
  round 2 hole 1: 1(-2.55,0) 2(2.55,0)
HC06
  round 1.524 hole 0.914: 1(11.684,-1.484) 2(9.184,-1.484) 3(6.583,-1.484) 4(4.085,-1.484)
HDR-TH_3P-P2.54-V-M
  rect 2x1.7 hole 1.1: 1(-2.54,0)
  round 2 hole 1.1: 2(0,0) 3(2.54,0)
HDR-TH_3P-P2.54-V-M-A
  rect 1.7x1.7 hole 1.1: 1(-2.54,0)
  round 1.7 hole 1.1: 2(0,0) 3(2.54,0)
HDR-TH_4P-P2.54-V-F
  rect 2x3 hole 1.1: 1(-3.81,0)
  oval 2x3 hole 1.1: 2(-1.27,0) 3(1.27,0) 4(3.81,0)
HDR-TH_7P-P2.54-V-F
  rect 1.575x2 hole 1.1: 1(-7.62,0)
  round 2 hole 1.1: 2(-5.08,0) 3(-2.54,0) 4(0,0) 5(2.54,0) 6(5.08,0) 7(7.62,0)
KEY-TH_4P-L6.0-W6.0-P6.50-LS4.5
  oval 3x2 hole 1: 1(-3.25,2.25) 2(3.25,2.25) 3(-3.25,-2.25) 4(3.25,-2.25)
LED-TH_4P-BD5.8_WS2812B-TH
  round 1.5 hole 0.8: 1(1.86,0.762) 2(0.62,-1.524) 3(-0.62,0.762) 4(-1.86,-1.524)
LED-TH_BD3.0-P2.54-FD-GREEN
  round 1.524 hole 0.914: 1(-1.27,0) 2(1.27,0)
LED-TH_BD5.0-P2.54-FD
  round 1.6 hole 1: 1(-1.27,0) 2(1.27,0)
N20_DC_MOTOR 3D
  round 2.2 hole 1: 1(-10.25,5) 2(-10.25,-5)
OPTO-TH_VS1838B
  rect 1.524x1.524 hole 0.914: 1(-2.54,0)
  round 1.524 hole 0.914: 2(0,0) 3(2.54,0)
PHOTO_RESISTOR
  round 1.5 hole 0.8: 1(0,1.7) 2(0,-1.7)
R_AXIAL-0.4
  round 1.879 hole 0.899: 1(-5.08,0) 2(5.08,0)
RES-TH_BD1.8-L3.2-P7.20-D0.4
  round 1.5 hole 0.8: 1(-3.6,0) 2(3.6,0)
SENSOR-TH_TEFT4300
  round 1.651 hole 0.965: 1(0,1.27) 2(0,-1.27)
SW-TH_HOOYA_SS-12D11G4
  oval 2.5x4 hole 1x1.8: 1(4.7,4.25) 2(0,4.25) 3(-4.7,4.25)
  oval 2x3 hole 0.5x1.6: 4(-6.5,-4.25) 5(6.5,-4.25)
TO-92-3_L4.8-W3.7-P2.54-L
  rect 1.8x1.8 hole 1: 1(-2.54,0)
  round 1.8 hole 1: 2(0,0) 3(2.54,0)
TO-92-3_L4.8-W3.7-P2.54-R
  rect 1.8x1.8 hole 1: 1(2.54,0)
  round 1.8 hole 1: 2(0,0) 3(-2.54,0)
ULTRASONIC-HC-SR04#V
  oval 2x3 hole 1: 1(-3.81,0) 2(-1.27,0) 3(1.27,0) 4(3.81,0)

## Nets
As in the schematic.

Pads without a net: H1 1; H3 1; SW1 3; U1 17 18 28 30; U2 6; U7 4; U16 1 2 3 4 5 6 8 10 13

## Via types
v1: diameter 0.61, hole 0.305, Top Layer to Bottom Layer, 34 vias

## Routing (per net, layer and track width the routed paths; a pad name or vN(x,y) marks a point on that pad's centre or on a via; arc(x,y) is an arc through that point)
+3.3V: length 36.7
  Top Layer w0.508: U17.OUT+ 46.75,48.93 48.45,47.24 R11.1 53.74,36.11
  Top Layer w1.016: 53.74,27.47 U16.9 53.74,38.65 55.26,40.17 57.55,40.17
+5V: length 65.2
  Bottom Layer w0.381: BUZZER1.1 64.66,59.72 U2.1
  Bottom Layer w0.508: U6.3 33.93,82.08 34.92,81.09 C12.1 ; U7.3 34.44,2.83 35.2,2.07 38.75,2.07 40.79,4.1 C13.1
  Bottom Layer w1.016: C2.1 95.9,18.81 95.9,16.04 94.76,14.9 U4.OUT+ ; C4.1 14.62,49.06 U5.1 ; v1(100.98,58.46) v1(96.67,58.46) ; v1(108.86,43.22) v1(108.86,47.79) ; C3.2 106.57,78.76 U1.27 ; C14.1 129.96,85.64 U15.3
GND: length 126.8
  Top Layer w1.016: C2.2 91.59,18.05 91.59,10.96 94.76,7.79 U4.OUT- ; C5.2 104.79,34.84 96.67,42.97 U2.10 ; U15.2 129.92,83.1 C14.2 ; v1(68.73,64.81) 70.76,62.78 v1(73.55,62.78) ; v1(91.59,51.86) 87.78,55.67 v1(85.24,55.67) ; v1(83.71,22.65) 85.24,22.65 v1(87.27,24.68) ; C3.1 102.76,79.03 101.49,77.76 U1.29 ; H1.3 v1(50.69,42.71)
  Bottom Layer w0.381: 56.25,67.4 53.71,67.4
  Bottom Layer w1.016: H1.3 58.57,42.71 59.96,41.31 U17.IN- ; v1(50.69,42.71) 47.9,42.71 46.12,40.93 46.12,39.57 ; U17.OUT- 46.09,39.54 46.12,39.57 ; 46.12,39.57 U16.12 ; C1.2 C5.2
VCC: length 175.1
  Top Layer w0.508: 114.64,17.14 113.46,18.33 109.62,18.33 106.57,21.38 106.57,34.84 97.17,44.24 72.54,44.24 67.2,49.57 60.25,49.57 59.96,49.28 U17.IN+
  Top Layer w0.762: 133.75,9.14 131.97,10.92 128.57,10.92 SW1.1
  Top Layer w1.016: 112.67,9.69 110.89,9.69 110.25,10.33 U4.IN+ ; SW1.1 128.54,13.37 127.4,14.52 117.52,14.52 114.95,17.09 C1.1 ; H3.2 115.72,9.69 116.48,10.45 116.48,13.25 114.7,15.03 C1.1 ; C1.1 114.64,17.14 104.71,17.14 102.51,19.34 102.51,34.84 96.92,40.43 U2.9 ; U17.IN+ 59.96,46.14 59.07,45.25 57.55,45.25
BT_RX: length 24.4
  Top Layer w0.381: BLUETOOTH1.3 87.54,65.55 89.05,64.05 105.56,64.05 U1.5
BT_TX: length 24
  Top Layer w0.381: BLUETOOTH1.4 91.02,65.32 106.83,65.32 U1.6
BUZZ: length 48.1
  Bottom Layer w0.381: U1.14 129.94,62.52 97.94,62.52 94.63,59.22 R1.2
ESP_RX: length 26.1
  Top Layer w0.381: v1(58.06,57.44) 55.01,54.4 50.88,54.4 D3.1
  Bottom Layer w0.381: v1(58.06,57.44) 58.06,65.32 57.35,66.03 52.39,66.03 J2.1
ESP_TX: length 14.2
  Bottom Layer w0.381: J1.1 51.2,61.68 59.63,53.26 R13.2
IR: length 22.9
  Top Layer w0.381: v1(125.88,68.87) 124.35,67.35 U1.11
  Bottom Layer w0.381: v1(125.88,68.87) 130.7,73.7 130.7,77 131.21,77.51 U15.1
LIGHT: length 14.1
  Bottom Layer w0.508: U1.24 114.19,76.96 R3.2 116.27,82.72 LDR1.2
LINE_C: length 125.9
  Bottom Layer w0.381: U8.5 20.21,47.79 21.1,48.68 21.1,60.62 25.29,64.81 39.64,64.81 46.88,72.05 67.58,72.05 72.28,76.75 92.35,76.75 96.67,72.43 119.53,72.43 121.81,74.72 U1.21
LINE_L: length 129.9
  Bottom Layer w0.381: U1.20 120.29,71.67 96.41,71.67 92.09,75.99 72.54,75.99 67.96,71.41 47.39,71.41 40.02,64.05 25.55,64.05 21.74,60.24 21.74,46.52 20.47,45.25 U8.4
LINE_LL: length 134.4
  Bottom Layer w0.381: U8.3 20.47,42.71 22.5,44.74 22.5,59.98 25.8,63.29 40.28,63.29 47.64,70.65 68.22,70.65 72.79,75.22 91.84,75.22 96.16,70.91 122.07,70.91 U1.19
LINE_R: length 121.4
  Bottom Layer w0.381: U8.6 19.96,50.33 20.47,50.84 20.47,61 25.04,65.57 39.39,65.57 46.5,72.68 67.2,72.68 72.03,77.51 92.6,77.51 96.92,73.19 118,73.19 119.27,74.46 U1.22
LINE_RR: length 116.1
  Bottom Layer w0.381: U1.23 116.73,74.46 116.22,73.95 97.17,73.95 92.86,78.27 71.77,78.27 66.95,73.45 46.12,73.45 39.01,66.33 24.78,66.33 19.7,61.25 19.7,53.89 U8.7
M1_IN1: length 58.6
  Top Layer w0.381: v1(118,56.94) 116.73,58.21 U1.8
  Bottom Layer w0.381: U2.7 80.41,35.35 82.95,37.89 82.95,50.59 88.03,55.67 116.73,55.67 v1(118,56.94)
M1_IN2: length 56
  Bottom Layer w0.381: U2.8 81.68,37.89 82.19,38.39 82.19,50.84 87.78,56.43 115.21,56.43 U1.9
M2_IN1: length 53.4
  Top Layer w0.381: U2.11 80.16,45.25 111.65,45.25 U1.12
M2_IN2: length 56.4
  Top Layer w0.381: U2.12 81.43,48.05 83.46,46.01 111.4,46.01 v1(122.57,57.19)
  Bottom Layer w0.254: U1.13 126.13,57.19 v1(122.57,57.19)
SIDE_L: length 7.1
  Bottom Layer w0.381: R9.1 111.61,75.78 U1.25
SIDE_R: length 8.8
  Bottom Layer w0.381: U1.26 109.37,75.73 110.89,77.26 110.89,80.86 R6.1
SONAR_ECHO: length 142.1
  Top Layer w0.178: 17.66,43.97 19.45,43.97
  Top Layer w0.381: v1(99.46,63.29) 77.11,63.29 v1(70.5,69.89) ; v1(23.25,46.52) 23.25,46.51 20.72,43.98 19.47,43.98 ; U5.3 14.89,43.71 17.15,43.71 17.4,43.97 17.66,43.97
  Bottom Layer w0.381: v1(70.5,69.89) 47.9,69.89 40.53,62.52 26.05,62.52 23.25,59.72 v1(23.25,46.52) ; v1(99.46,63.29) 131.72,63.29 U1.15
SONAR_TRIG: length 148.8
  Top Layer w0.178: 19.69,46.52 19.68,46.53 17.67,46.53
  Top Layer w0.381: 17.67,46.53 16.92,46.53 16.66,46.27 U5.2 ; v1(24.28,49.06) 22.76,49.06 20.22,46.52 19.69,46.52 ; v1(69.74,69.13) 76.35,62.52 v1(92.86,62.52)
  Bottom Layer w0.381: v1(92.86,62.52) 97.25,62.52 98.78,64.05 131.72,64.05 134.51,66.84 U1.16 ; v1(24.28,49.06) 24.28,59.73 26.31,61.76 40.79,61.76 48.15,69.13 v1(69.74,69.13)
WS2812: length 81.2
  Top Layer w0.381: v1(93.87,83.61) 93.87,76.24 98.44,71.67 115.21,71.67 121.81,65.06 U1.10
  Bottom Layer w0.381: v1(93.87,83.61) 93.87,85.89 89.55,90.21 65.21,90.21 R12.1
~SIDE_EN: length 102.5
  Top Layer w0.381: Q4.2 65.17,12.23 v1(68.22,12.23) ; U1.7 108.48,54.78 v1(107.59,54.78)
  Bottom Layer w0.381: R10.1 Q4.2 ; v1(107.59,54.78) 88.41,54.78 83.71,50.08 83.71,37.12 82.19,35.6 82.19,27.73 85.49,24.42 85.49,16.55 81.17,12.23 v1(68.22,12.23)
$1N1464: length 4.7
  Bottom Layer w0.508: R1.1 78.84,54.86 78.63,54.65
$1N1467: length 8.7
  Top Layer w0.508: 76.09,54.65 75.83,54.91 BUZZER1.2
$1N1626: length 24
  Top Layer w0.381: U6.1 37.66,90.21 52.43,90.21 R12.2
$1N1633: length 83
  Top Layer w0.381: U6.4 36.21,82.25 26.05,72.09 v1(26.05,56.94)
  Bottom Layer w0.381: U7.1 34.44,9.95 26.05,18.33 v1(26.05,56.94)
$1N4176: length 4.4
  Top Layer w0.762: 133.75,16.34 133.5,16.59 LED1.1
$1N4272: length 36.9
  Bottom Layer w1.016: M1.1 73.63,69.89 ; 73.63,69.89 C7.2 ; 73.63,69.89 70.5,66.76 70.5,49.57 66.44,45.51 U2.2
$1N4279: length 43
  Bottom Layer w1.016: M1.2 83.63,71.33 82.19,69.89 C7.1 78.61,68.11 73.81,68.11 72.03,66.33 72.03,48.89 66.1,42.97 U2.3
$1N5250: length 5.6
  Bottom Layer w0.61: XP1.2 5.48,86.15 Q2.1
$1N5251: length 18.4
  Bottom Layer w0.61: D1.2 11.83,89.19 2.94,89.19 XP1.3 3.19,87.92 6.24,87.92 Q2.2
$1N5405: length 12.8
  Bottom Layer w0.61: D1.1 12.34,82.59 5.73,82.59 4.72,83.61 XP1.1
$1N5525: length 18.2
  Bottom Layer w0.61: Q3.2 7,6.14 3.7,6.14 2.94,6.9 2.69,6.9 XP2.1 3.45,8.17 12.34,8.17 D2.2
$1N5528: length 5.1
  Bottom Layer w0.61: Q3.1 4.72,3.85 3.96,4.61 XP2.2
$1N5529: length 12.4
  Bottom Layer w0.61: D2.1 12.34,2.07 XP2.3
$1N5700: length 19.8
  Bottom Layer w0.508: R4.1 58.82,81.32 48.41,81.32 45.61,84.11 XP3.1
$1N5728: length 64.6
  Bottom Layer w0.381: 70.18,79.03 91.84,79.03 95.63,82.82 C8.2 ; 70.18,79.03 66.19,79.03 62.63,82.59 50.18,82.59 XP3.2 ; 70.18,79.03 70.18,79.01 R5.2
  Bottom Layer w0.508: C8.2 97.96,82.84 R6.2
$1N5983: length 25.6
  Bottom Layer w0.508: R7.1 67.96,15.03 57.3,4.36 XP4.3
$1N6012: length 161.3
  Top Layer w0.381: v1(95.9,37.63) 95.9,36.36 84.47,24.93 68.77,24.93 R8.1
  Top Layer w0.508: R8.1 64.66,20.61 62.12,18.07 57.3,18.07 55.52,16.3 55.52,13.76 XP4.2
  Bottom Layer w0.381: v1(95.9,37.63) 109.62,37.63 121.3,49.32 128.92,49.32 137.31,57.7 137.31,82.59 132.23,87.67 126.66,87.67 C9.2
  Bottom Layer w0.508: C9.2 121.79,82.84 R9.2
$1N6146: length 101.5
  Top Layer w0.508: XP3.3 49.68,86.57 49.68,79.54 45.87,75.73 v1(45.87,64.52) ; v1(53.23,47.79) 55.52,50.08 v1(55.52,53.14)
  Bottom Layer w0.381: v1(55.52,53.14) 55.52,56.68 53.99,58.21 47.64,58.21 45.87,59.98 v1(45.87,64.52)
  Bottom Layer w0.508: v1(53.23,47.79) 53.23,39.16 59.07,33.31 Q4.1 54.5,11.22 48.91,11.22 45.19,7.49 XP4.1
$1N7817: length 60.9
  Top Layer w0.381: 51.17,67.4 52.65,68.87 57.3,68.87 58.06,68.11 58.06,63.03 60.34,60.75 75.33,60.75 76.46,61.88 102.65,61.88 U1.3
$1N7877: length 51.7
  Top Layer w0.381: U1.1 98.44,61 76.6,61 75.58,59.98 56.28,59.98 55.01,61.25 55.01,63.54 53.74,64.81
  Bottom Layer w0.381: 56.28,64.81 53.74,64.81
$1N8038: length 19.7
  Bottom Layer w0.381: U16.14 41.25,33.52 R11.2 41.36,36.22 D3.2
$1N8431: length 13.7
  Bottom Layer w0.381: KEY1.2 45.61,20.96 45.61,29.25 48.66,32.3 U16.11
$1N8535: length 14.1
  Bottom Layer w0.381: KEY2.4 KEY2.3 31.93,29.29 U16.16
$1N9044: length 33.5
  Bottom Layer w1.016: U2.4 66.95,40.43 79.63,27.75 C6.2 82.19,21.88 83.63,20.44 M2.1
$1N9105: length 29.6
  Bottom Layer w1.016: U2.5 66.95,37.89 77.13,27.71 C6.1 74.82,21.88 73.63,20.69 M2.2 73.55,17.74
$1N12441: length 24.5
  Top Layer w0.381: v1(44.6,44.49) 38.5,38.39 U16.15
  Bottom Layer w0.381: v1(44.6,44.49) 51.71,51.6 R13.1
$1N12605: length 58.5
  Top Layer w0.381: v1(88.34,51.6) 63.9,51.6 v1(62.12,53.38) ; U1.2 v1(94.56,53.56) ; J1.3 57.55,61 v1(59.07,61)
  Bottom Layer w0.381: J1.3 J1.2 ; v1(59.07,61) 59.07,56.43 v1(62.12,53.38) ; v1(88.34,51.6) 90.3,53.56 v1(94.56,53.56)
$1N12810: length 19.3
  Top Layer w0.254: F1.1 122.83,20.61 122.5,20.28 122.5,19.67 123.28,18.89 123.28,18.53 122.83,18.07 F1.2
  Bottom Layer w1.27: F1.1 127.91,16.81 D4.1 ; SW1.2 123.84,15.78 F1.2
$1N12946: length 47.1
  Bottom Layer w1.27: BAT1.1 114.57,35.22 D4.2

## Copper pours and planes (outline as drawn; the poured copper is in the pictures)
+5V on Top Layer: 6.7,91.01 139.08,91.01 139.08,-0.21 6.7,-0.21
GND on Bottom Layer: 6.73,91.01 139.34,91.01 139.34,-0.21 6.73,-0.21

## Text on the board
Bottom Silkscreen Layer: gnd | L    A1 | C    A2 | R    A3 | RR   A4 | LL   A0 | Echo D12 | Trig D13 | D7 | Right   A7 | Left    A6 | EN     D4 | D11 | IN2  ~D10 | IN1  ~D9 | IN2  ~D6 | IN1  ~D5 | Tx  D3 | Rx  D2 | A5 | D8 | GND | +BAT | v. 1.0 | vergilium2@gmail.com | Nano | ByByte | OFF | ON | Line Trackers | Ultrasonic | RGB | Side Sensors | BUZZER | Motor Left | Motor Right | Bluetooth | Light | IR
Top Silkscreen Layer: 3.3v | VCC | GND | 5v | Made in / UKRAINE | NANO | ESP-CAM | Arduino Nano | ESP  JAMPERS | "БАБАЙ"
